# Altium schematic sheet Schematic.SchDoc
size D
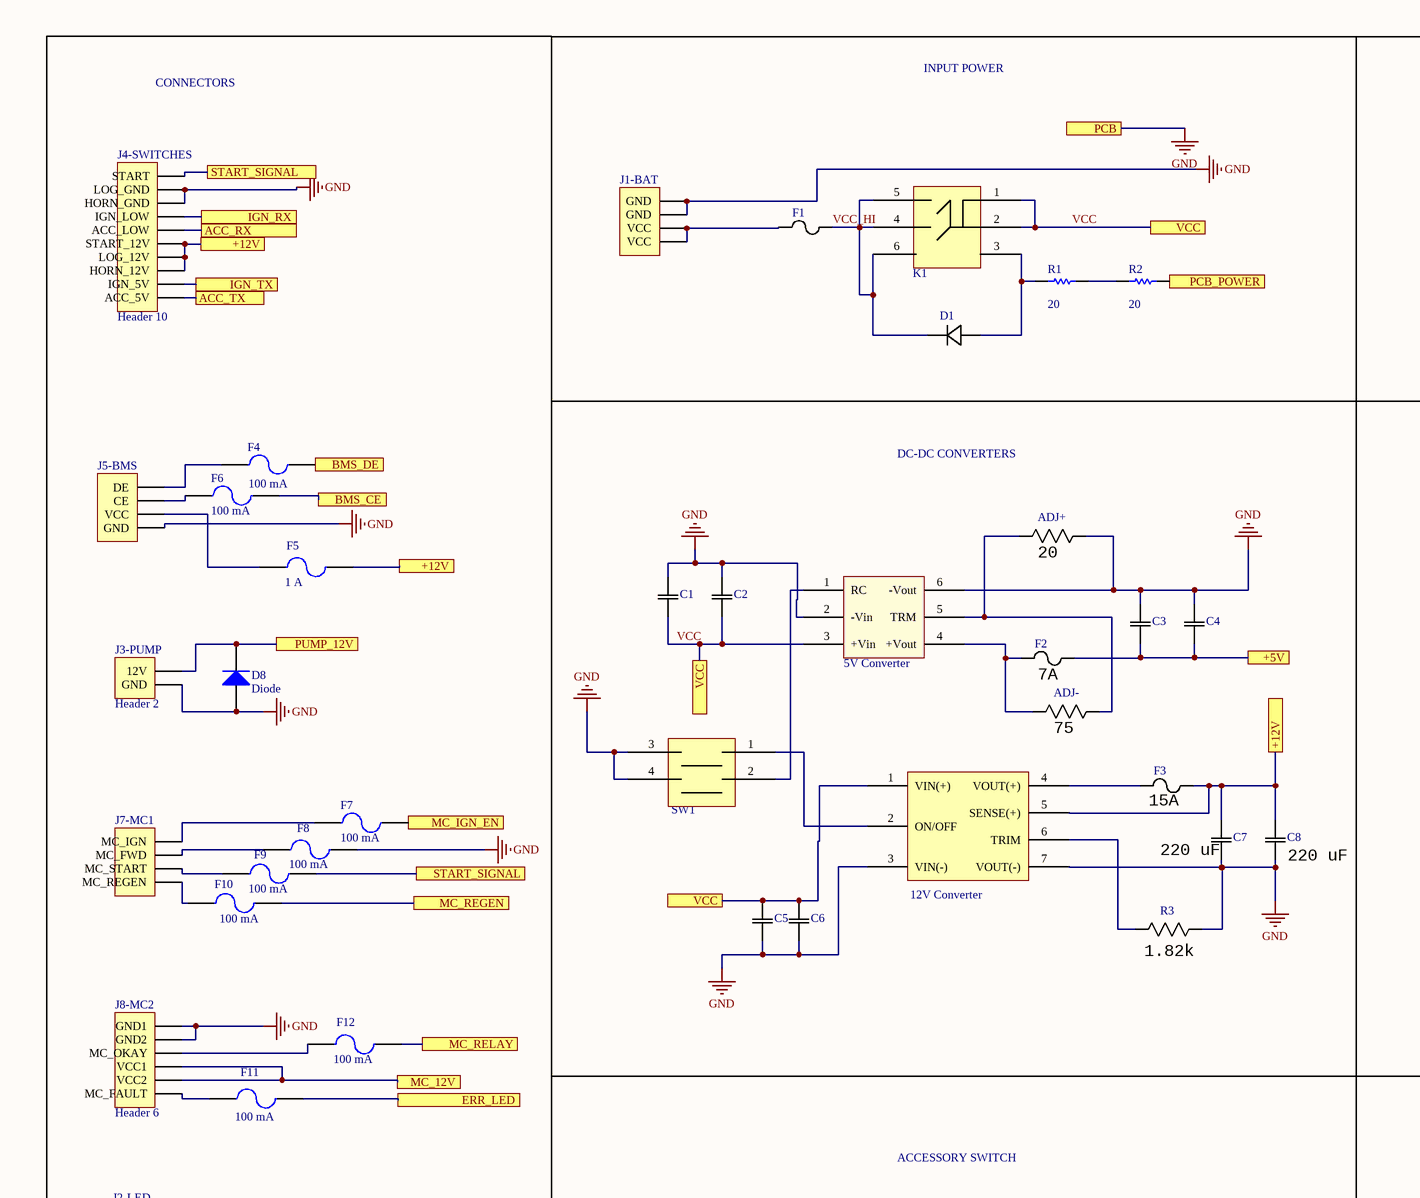
[diagram p0: Schematic.SchDoc, top left]
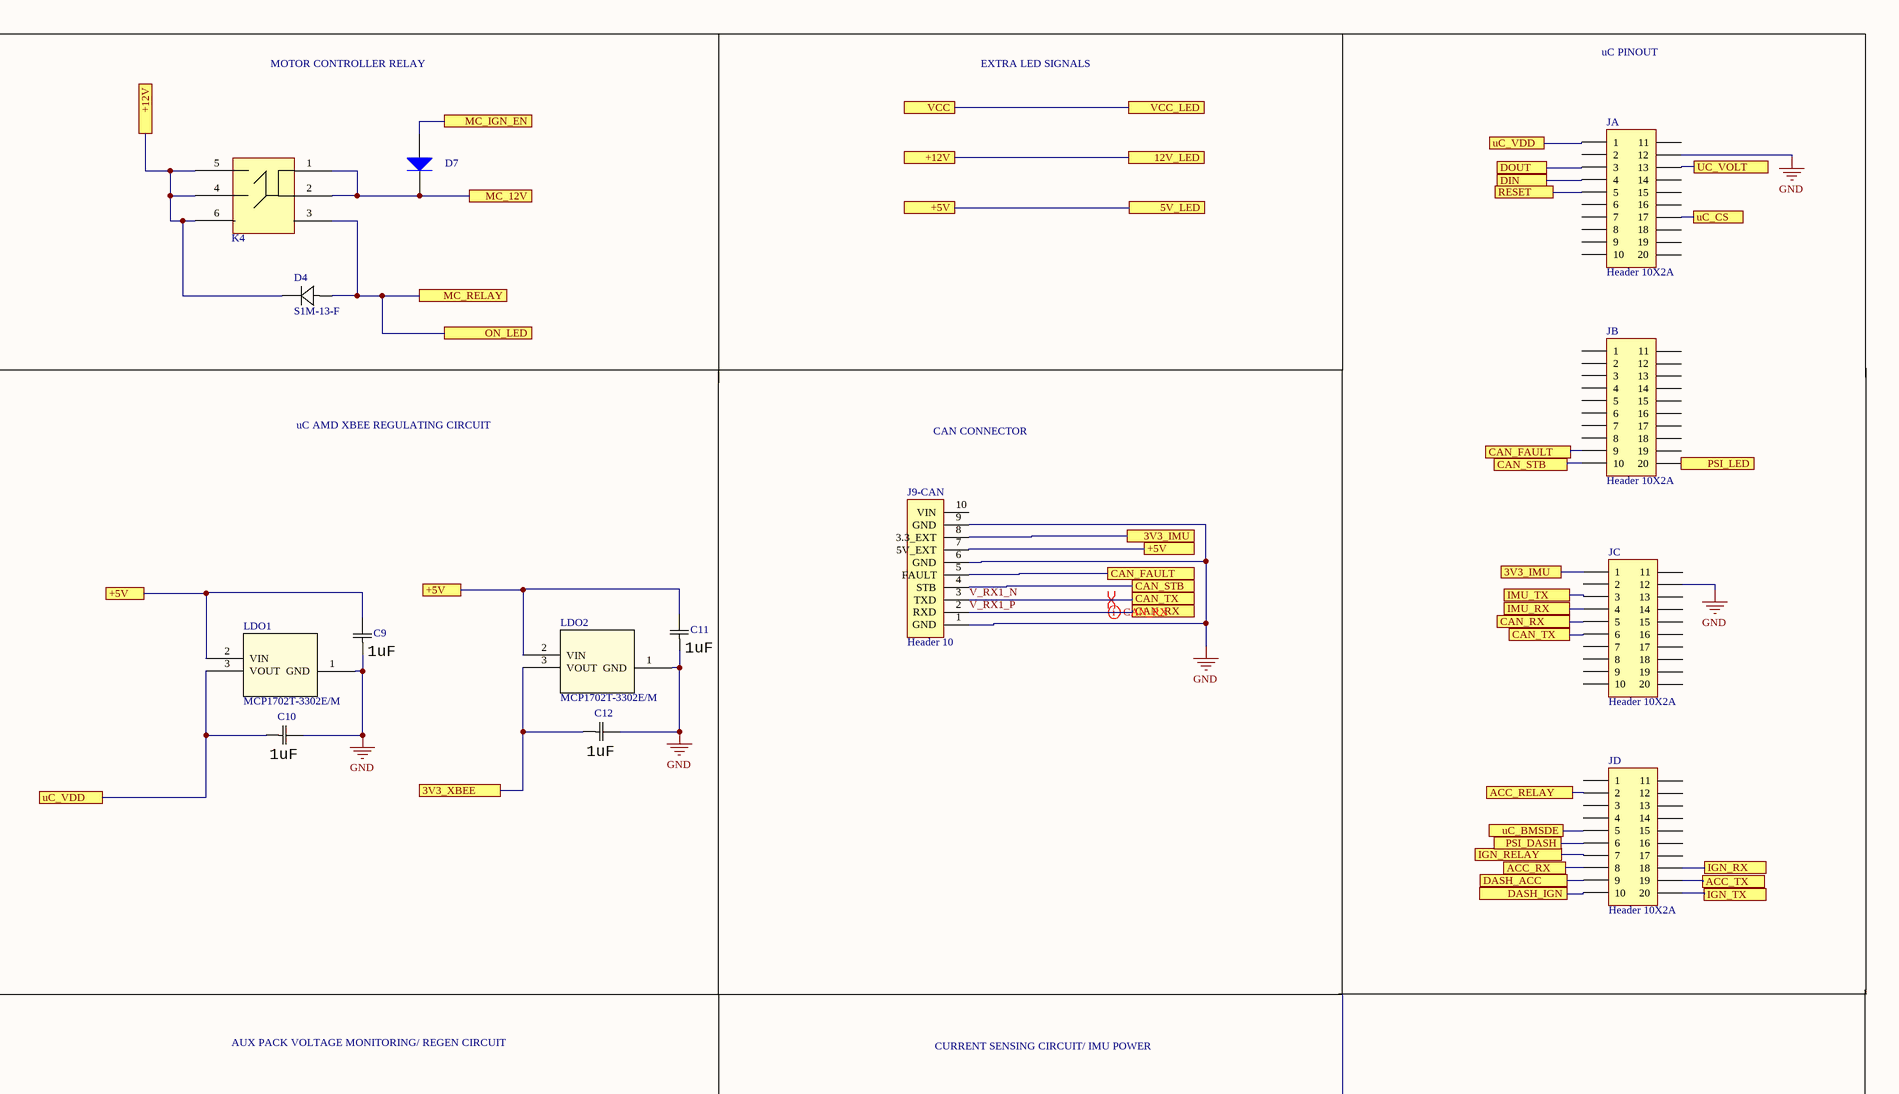
[diagram p1: Schematic.SchDoc, top right]
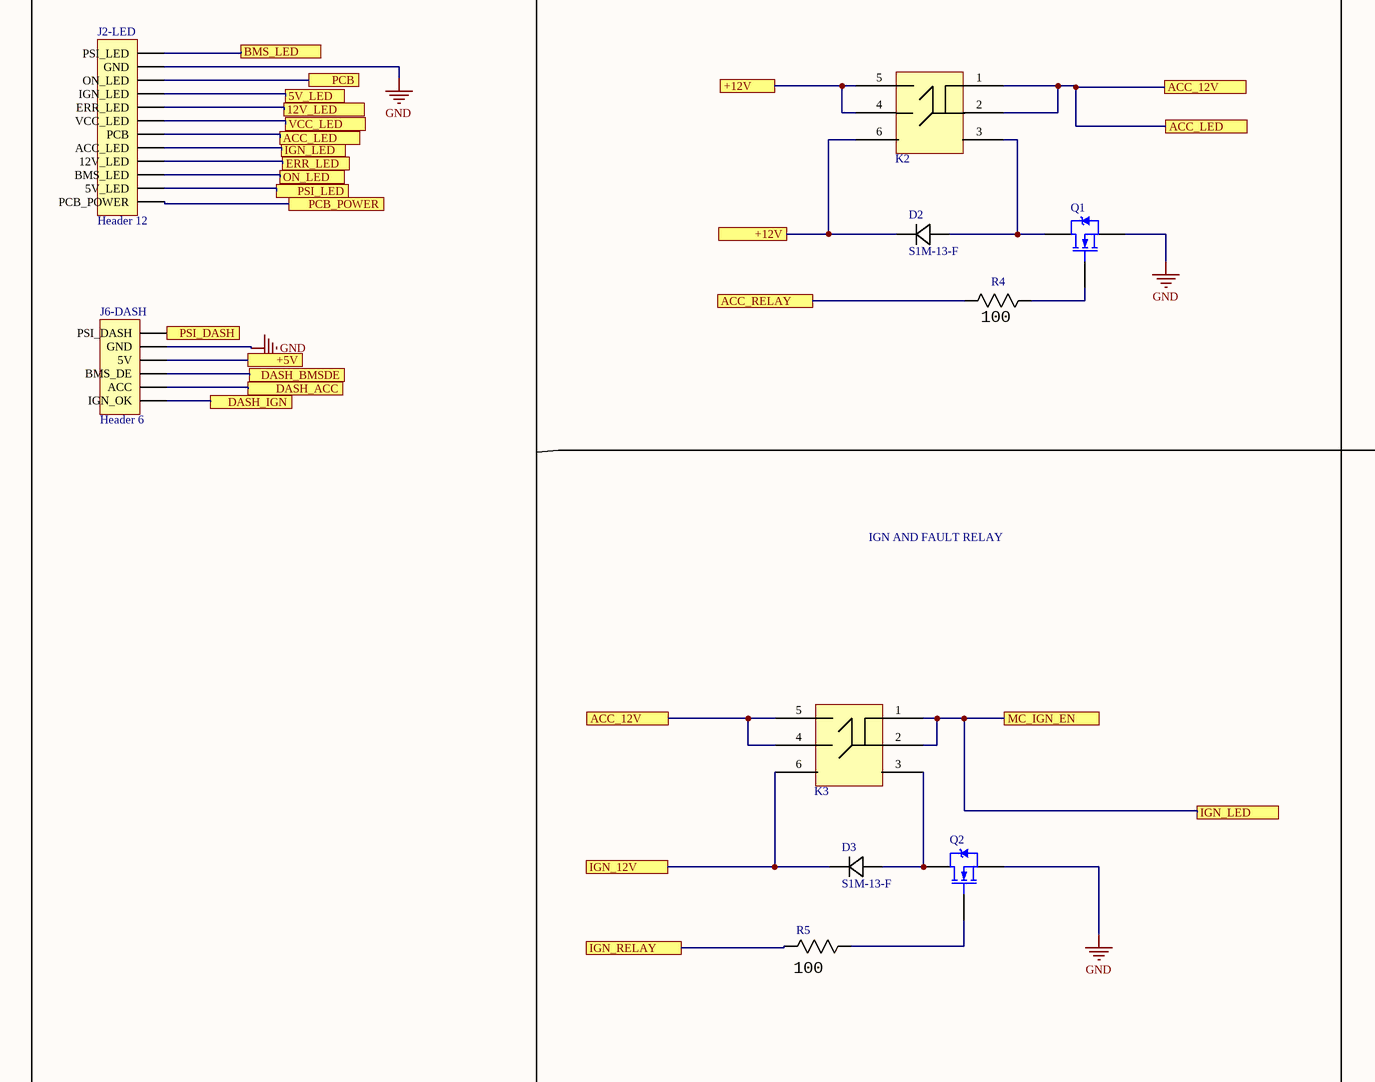
[diagram p2: Schematic.SchDoc, bottom left]
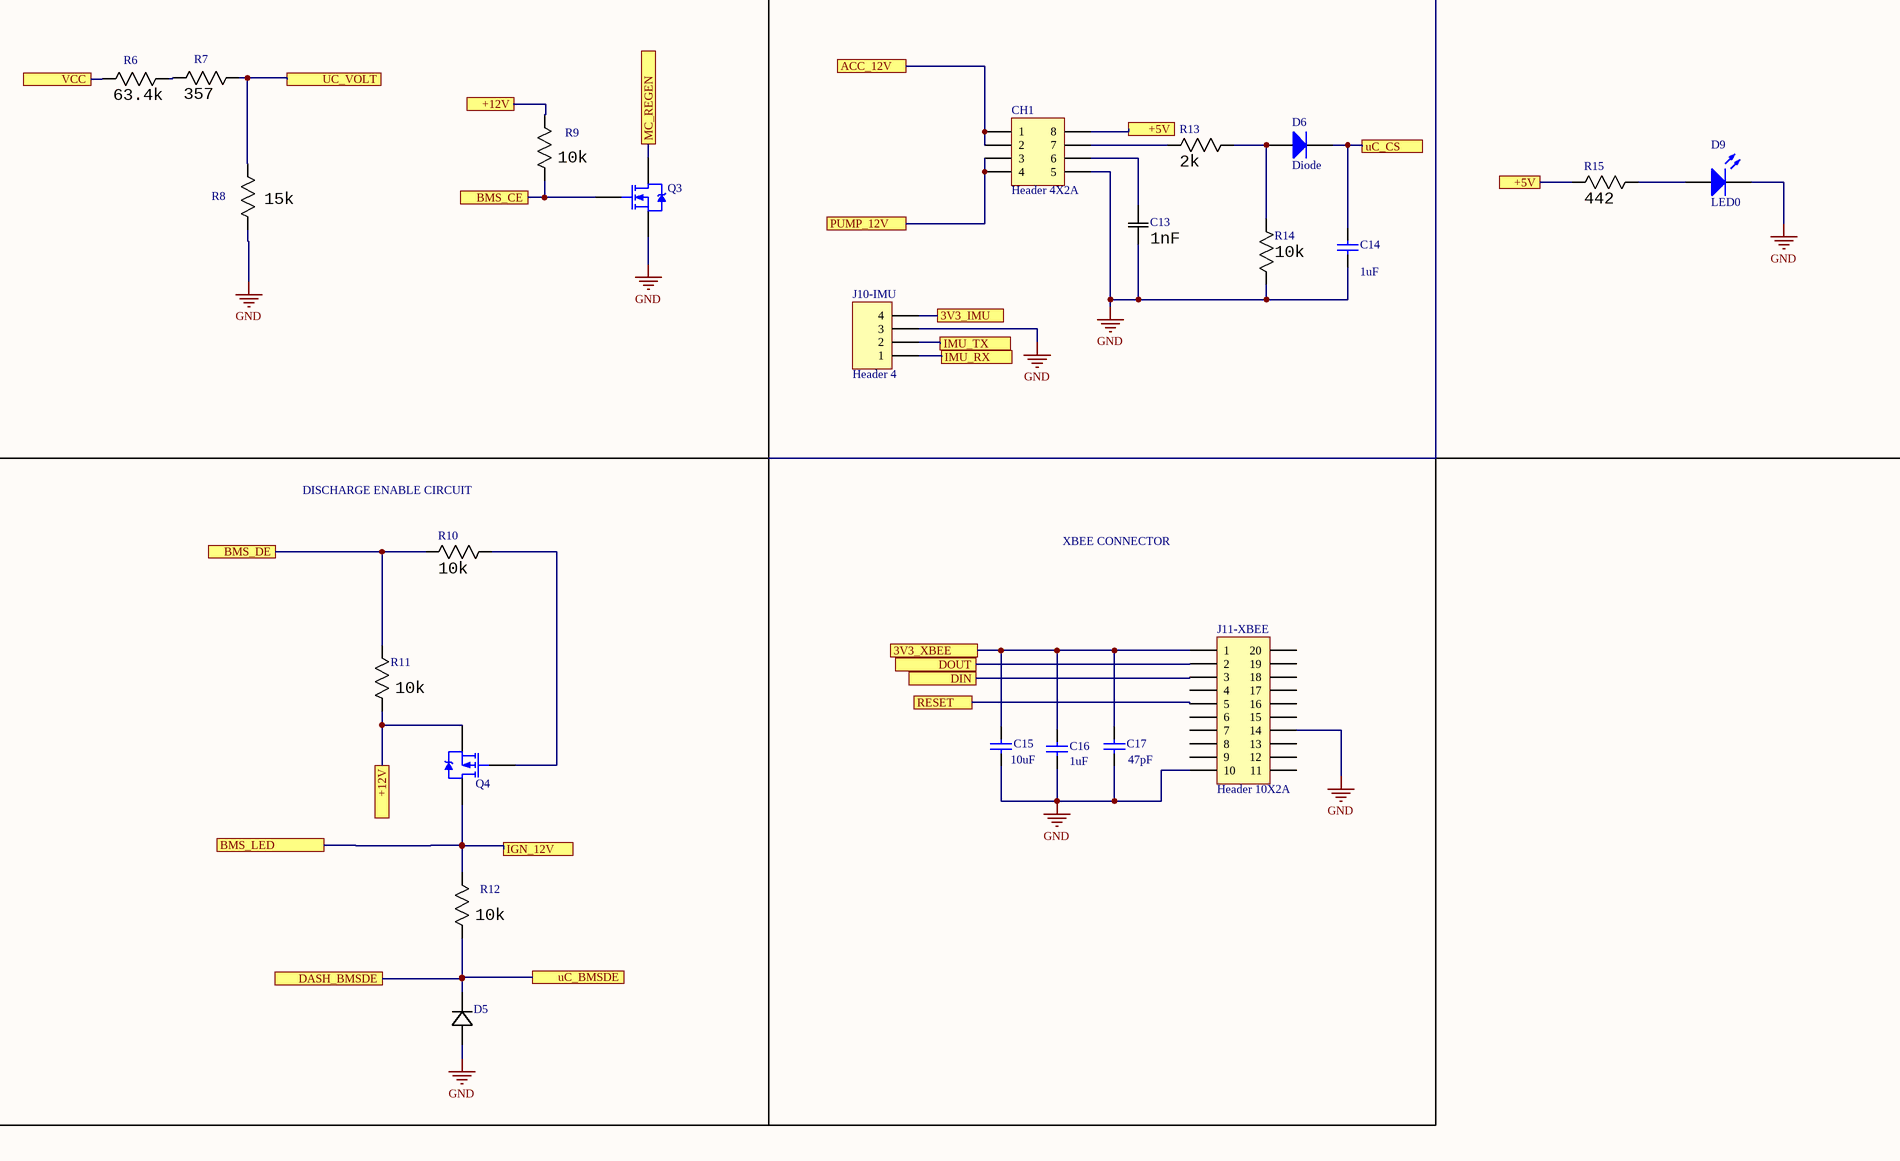
[diagram p3: Schematic.SchDoc, bottom right]

## Parts
5V_Converter  5V CONVERTER  [5V_Converter]  (value not drawn)
12V  Component_3  [12V_Converter]  (value not drawn)
ADJ+  value 20  [RC1206N]  (hidden comment: ERJ-8ENF20R0V)
ADJ-  value 75  [RC1206N]  (hidden comment: ERJ-8ENF20R0V)
C1  TPSE476K035R0200  [CAP_TPS_E]  (value not drawn)
C2  TPSE476K035R0200  [CAP_TPS_E]  (value not drawn)
C3  TPSE476K035R0200  [CAP_TPS_E]  (value not drawn)
C4  TPSE476K035R0200  [CAP_TPS_E]  (value not drawn)
C5  TPSE476K035R0200  [CAP_TPS_E]  (value not drawn)
C6  TPSE476K035R0200  [CAP_TPS_E]  (value not drawn)
C7  value 220 uF  [CAP_TPS_E]  (hidden comment: TPSE476K035R0200)
C8  value 220 uF  [CAP_TPS_E]  (hidden comment: TPSE476K035R0200)
C9  value 1uF  [0603 Cap]  (hidden comment: TPSE476K035R0200)
C10  value 1uF  [0603 Cap]  (hidden comment: TPSE476K035R0200)
C11  value 1uF  [0603 Cap]  (hidden comment: TPSE476K035R0200)
C12  value 1uF  [0603 Cap]  (hidden comment: TPSE476K035R0200)
C13  value 1nF  [0603 Cap]  (hidden comment: TPSE476K035R0200)
C14  value 1uF  [0603 Cap]  (hidden comment: Cap)
C15  value 10uF  [CAP_3216]  (hidden comment: Cap)
C16  value 1uF  [0603 Cap]  (hidden comment: Cap)
C17  value 47pF  [0603 Cap]  (hidden comment: Cap)
CH1  Header 4X2A  [ACS712]
D1  S1M-13-F  [SMA]  (value not drawn)
D2  S1M-13-F  [SMA]
D3  S1M-13-F  [SMA]
D4  S1M-13-F  [SMA]
D5  DZ2J033M0L  [SMini2-F5-B]  (value not drawn)
D6  Diode  [ONSC-SOD-323-2-477-02_G_V]
D7  Diode  [REV_DIODE]  (value not drawn)
D8  Diode  [REV_DIODE]
D9  LED0  [RC1206N]
F1  3413.0330.22  [FUS_SCHURTER_341]  (value not drawn)
F2  value 7A  [FUS_SCHURTER_341]  (hidden comment: 3413.0330.22)
F3  value 15A  [FUS_SCHURTER_341]  (hidden comment: 3413.0330.22)
F4  100 mA  [0603]
F5  1 A  [0466Series]
F6  100 mA  [0603]
F7  100 mA  [0603]
F8  100 mA  [0603]
F9  100 mA  [0603]
F10  100 mA  [0603]
F11  100 mA  [0603]
F12  100 mA  [0603]
J1-BAT  Header 4  [4-pin]  (value not drawn)
J2-LED  Header 12  [12_pinnn]
J3-PUMP  Header 2  [2-pin]
J4-SWITCHES  Header 10  [12-pin]
J5-BMS  Header 4  [4-pin]  (value not drawn)
J6-DASH  Header 6  [6-pin]
J7-MC1  Header 4  [4-pin]  (value not drawn)
J8-MC2  Header 6  [6-pin]
J9-CAN  Header 10  [12-pin]
J10-IMU  Header 4  [4-pin]
J11-XBEE  Header 10X2A  [XBEE]
JA  Header 10X2A  [uC_Pins]
JB  Header 10X2A  [uC_Pins]
JC  Header 10X2A  [uC_Pins]
JD  Header 10X2A  [uC_Pins]
K1  Relays  [Relays]  (value not drawn)
K2  Relays  [Relays]  (value not drawn)
K3  Relays  [Relays]  (value not drawn)
K4  Relays  [Relays]  (value not drawn)
LDO1  MCP1702T-3302E/M  [SOT-89_3MC]
LDO2  MCP1702T-3302E/M  [SOT-89_3MC]
Q1  NMOS-2  [SOT23_M]  (value not drawn)
Q2  NMOS-2  [SOT23_M]  (value not drawn)
Q3  NMOS-2  [DMN13H750S]  (value not drawn)
Q4  PMOS-2  [PCBComponent_1]  (value not drawn)
R1  value 20  [RC1206N]  (hidden comment: Res1)
R2  value 20  [RC1206N]  (hidden comment: Res1)
R3  value 1.82k  [RC1210N]  (hidden comment: ERJ-14NF1821U)
R4  value 100  [RC1206N]  (hidden comment: NTC0805J10K)
R5  value 100  [RC1206N]  (hidden comment: NTC0805J10K)
R6  value 63.4k  [RC1206N]  (hidden comment: ERJ-8ENF20R0V)
R7  value 357  [RC1206N]  (hidden comment: ERJ-8ENF20R0V)
R8  value 15k  [RC1206N]  (hidden comment: ERJ-2BSFR10X)
R9  value 10k  [RC1206N]  (hidden comment: ERJ-8ENF20R0V)
R10  value 10k  [RC1206N]  (hidden comment: ERJ-8ENF20R0V)
R11  value 10k  [RC1206N]  (hidden comment: ERJ-8ENF20R0V)
R12  value 10k  [RC1206N]  (hidden comment: ERJ-8ENF20R0V)
R13  value 2k  [RC1206N]  (hidden comment: ERJ-8ENF20R0V)
R14  value 10k  [RC1206N]  (hidden comment: ERJ-8ENF20R0V)
R15  value 442  [RC1206N]  (hidden comment: ERJ-8ENF20R0V)
S1  Component_2  [SW1]  (value not drawn)

## Ports
3V3_IMU, 3V3_XBEE, 5V_LED, 12V_LED, +5V, +12V, ACC_12V, ACC_LED, ACC_RELAY, ACC_RX, ACC_TX, BMS_CE, BMS_DE, BMS_LED, CAN_FAULT, CAN_RX, CAN_STB, CAN_TX, DASH_ACC, DASH_BMSDE, DASH_IGN, DIN, DOUT, ERR_LED, IGN_12V, IGN_LED, IGN_RELAY, IGN_RX, IGN_TX, IMU_RX, IMU_TX, MC_12V, MC_IGN_EN, MC_REGEN, MC_RELAY, ON_LED, PCB, PCB_POWER, PSI_DASH, PSI_LED, PUMP_12V, RESET, START_SIGNAL, uC_BMSDE, uC_CS, uC_VDD, UC_VOLT, VCC, VCC_LED

## Nets
GND: 5V_Converter.2(-Vin) 5V_Converter.6(-Vout) 12V.3(VIN(-)) 12V.7(VOUT(-)) ADJ+.1 C1.2 C2.2 C3.2 C4.2 C5.1 C6.1 C7.1 C8.1 C9.1 C10.2 C11.1 C12.2 C13.1 C14.1 C15.1 C16.1 C17.1 CH1.5 D5.2 D8.1(A) D9.2(K) F8.2 J1-BAT.1(GND) J1-BAT.2(GND) J2-LED.10(ON_LED) J2-LED.11(GND) J3-PUMP.1(GND) J4-SWITCHES.8(HORN_GND) J4-SWITCHES.9(LOG_GND) J5-BMS.4(GND) J6-DASH.5(GND) J8-MC2.5(GND2) J8-MC2.6(GND1) J9-CAN.1(GND) J9-CAN.6(GND) J9-CAN.9(GND) J10-IMU.3 J11-XBEE.10 J11-XBEE.14 JA.12 JC.12 LDO1.1(GND) LDO2.1(GND) Q1.3(S) Q2.3(S) Q3.3(S) R3.1 R8.2 R14.1 S1.3 S1.4 ; port PCB
3V3_IMU: J9-CAN.8(3.3_EXT) J10-IMU.4 JC.1 ; port 3V3_IMU
3V3_XBEE: C12.1 C15.2 C16.2 C17.2 J11-XBEE.1 LDO2.3(VOUT) ; port 3V3_XBEE
+5V: C3.1 C4.1 C9.2 C11.2 CH1.8 F2.2 J2-LED.9(IGN_LED) J6-DASH.4(5V) J9-CAN.7(5V_EXT) LDO1.2(VIN) LDO2.2(VIN) R15.1 ; port +5V, port 5V_LED
+12V: 12V.5(SENSE(+)) C7.2 C8.2 D2.1 D4.1 F3.2 F5.2 J2-LED.8(ERR_LED) J4-SWITCHES.3(HORN_12V) J4-SWITCHES.4(LOG_12V) J4-SWITCHES.5(START_12V) K2.4 K2.5 K2.6 K4.4 K4.5 K4.6 Q4.3(S) R9.1 R11.2 ; port +12V, port 12V_LED
ACC_12V: CH1.1 CH1.2 J2-LED.6(PCB) K2.1 K2.2 K3.4 K3.5 ; port ACC_12V, port ACC_LED
ACC_RELAY: JD.2 R4.2 ; port ACC_RELAY
ACC_RX: J4-SWITCHES.6(ACC_LOW) JD.8 ; port ACC_RX
ACC_TX: J4-SWITCHES.1(ACC_5V) JD.19 ; port ACC_TX
BMS_CE: F6.2 Q3.1(G) R9.2 ; port BMS_CE
BMS_DE: F4.2 R10.1 R11.1 ; port BMS_DE
BMS_LED: D3.1 J2-LED.12(PSI_LED) K3.6 Q4.2(D) R12.1 ; port IGN_12V, port BMS_LED
CAN_FAULT: J9-CAN.5(FAULT) JB.9 ; port CAN_FAULT
CAN_STB: J9-CAN.4(STB) JB.10 ; port CAN_STB
DASH_ACC: J6-DASH.2(ACC) JD.9 ; port DASH_ACC
DASH_BMSDE: D5.1 J6-DASH.3(BMS_DE) JD.5 R12.2 ; port DASH_BMSDE, port uC_BMSDE
DASH_IGN: J6-DASH.1(IGN_OK) JD.10 ; port DASH_IGN
DIN: J11-XBEE.3 JA.4 ; port DIN
DOUT: J11-XBEE.2 JA.3 ; port DOUT
ERR_LED: F11.2 J2-LED.4(12V_LED) ; port ERR_LED
IGN_LED: D7.1(A) F7.2 J2-LED.5(ACC_LED) K3.1 K3.2 ; port MC_IGN_EN, port IGN_LED
IGN_RELAY: JD.7 R5.2 ; port IGN_RELAY
IGN_RX: J4-SWITCHES.7(IGN_LOW) JD.18 ; port IGN_RX
IGN_TX: J4-SWITCHES.2(IGN_5V) JD.20 ; port IGN_TX
IMU_RX: J10-IMU.1 JC.4 ; port IMU_RX
IMU_TX: J10-IMU.2 JC.3 ; port IMU_TX
MC_12V: D7.2(K) J8-MC2.2(VCC2) J8-MC2.3(VCC1) K4.1 K4.2 ; port MC_12V
MC_REGEN: F10.2 Q3.2(D) ; port MC_REGEN
MC_RELAY: D4.2 F12.2 J2-LED.3(BMS_LED) K4.3 ; port MC_RELAY, port ON_LED
PCB_POWER: J2-LED.1(PCB_POWER) R2.2 ; port PCB_POWER
PSI_DASH: J6-DASH.6(PSI_DASH) JD.6 ; port PSI_DASH
PSI_LED: J2-LED.2(5V_LED) JB.20 ; port PSI_LED
PUMP_12V: CH1.3 CH1.4 D8.2(K) J3-PUMP.2(12V) ; port PUMP_12V
RESET: J11-XBEE.5 JA.5 ; port RESET
START_SIGNAL: F9.2 J4-SWITCHES.10(START) ; port START_SIGNAL
uC_CS: C14.2 D6.2(K) JA.17 ; port uC_CS
uC_VDD: C10.1 JA.1 LDO1.3(VOUT) ; port uC_VDD
UC_VOLT: JA.13 R7.1 R8.1 ; port UC_VOLT
V_RX1_N: J9-CAN.3(TXD) JC.6 ; port CAN_TX
V_RX1_P: J9-CAN.2(RXD) JC.5 ; port CAN_RX
VCC: 5V_Converter.3(+Vin) 12V.1(VIN(+)) C1.1 C2.1 C5.2 C6.2 J2-LED.7(VCC_LED) K1.1 K1.2 R6.2 ; port VCC, port VCC_LED
VCC_HI: D1.1 F1.2 K1.4 K1.5 K1.6
Net5V_Converter_1: 5V_Converter.1(RC) S1.2
Net5V_Converter_4: 5V_Converter.4(+Vout) ADJ-.2 F2.1
Net5V_Converter_5: 5V_Converter.5(TRM) ADJ+.2 ADJ-.1
Net12V_2: 12V.2(ON/OFF) S1.1
Net12V_4: 12V.4(VOUT(+)) F3.1
Net12V_6: 12V.6(TRIM) R3.2
NetC13_2: C13.2 CH1.6
NetCH1_7: CH1.7 R13.1
NetD1_2: D1.2 K1.3 R1.1
NetD2_2: D2.2 K2.3 Q1.2(D)
NetD3_2: D3.2 K3.3 Q2.2(D)
NetD6_1: D6.1(A) R13.2 R14.2
NetD9_1: D9.1(A) R15.2
NetF1_1: F1.1 J1-BAT.3(VCC) J1-BAT.4(VCC)
NetF4_1: F4.1 J5-BMS.1(DE)
NetF5_1: F5.1 J5-BMS.3(VCC)
NetF6_1: F6.1 J5-BMS.2(CE)
NetF7_1: F7.1 J7-MC1.1(MC_IGN)
NetF8_1: F8.1 J7-MC1.2(MC_FWD)
NetF9_1: F9.1 J7-MC1.3(MC_START)
NetF10_1: F10.1 J7-MC1.4(MC_REGEN)
NetF11_1: F11.1 J8-MC2.1(MC_FAULT)
NetF12_1: F12.1 J8-MC2.4(MC_OKAY)
NetQ1_1: Q1.1(G) R4.1
NetQ2_1: Q2.1(G) R5.1
NetQ4_1: Q4.1(G) R10.2
NetR1_2: R1.2 R2.1
NetR6_1: R6.1 R7.2

Not connected (* = marked no-connect by the designer): J9-CAN 10(VIN); J11-XBEE 4 6 7 8 9 11 12 13 15 16 17 18 19 20; JA 2 6 7 8 9 10 11 14 15 16 18 19 20; JB 1 2 3 4 5 6 7 8 11 12 13 14 15 16 17 18 19; JC 2 7 8 9 10 11 13 14 15 16 17 18 19 20; JD 1 3 4 11 12 13 14 15 16 17

## Layout directives
differential pair: V_RX1_N, V_RX1_P

## Notes on the sheet
- CONNECTORS
- INPUT POWER
- MOTOR CONTROLLER RELAY
- EXTRA LED SIGNALS
- uC PINOUT
- DC-DC CONVERTERS
- uC AMD XBEE REGULATING CIRCUIT
- CAN CONNECTOR
- (near S1) SW1
- (near 12V) 12V Converter
- ACCESSORY SWITCH
- AUX PACK VOLTAGE MONITORING/ REGEN CIRCUIT
- CURRENT SENSING CIRCUIT/ IMU POWER
- IGN AND FAULT RELAY
- DISCHARGE ENABLE CIRCUIT
- XBEE CONNECTOR

## Library data of the parts
ADJ+ ADJ- R6-R15 = ERJ-8ENF20R0V: Imported; Vendor: Panasonic; Built_By: EMA_UL_Team; C: Copyright (C) 2015 Accelerated Designs. All rights reserved; Manufacturer_Part_Number: ERJ-8ENF20R0V; RefDes: RefDes; Type: DEV
C1 C2 C5-C13 = TPSE476K035R0200: Imported; Vendor: AVX Corporation; Built_By: EMA_UL_Team; Type: DEV; C: Copyright (C) 2015 Accelerated Designs. All rights reserved; Manufacturer_Part_Number: TPSE476K035R0200; RefDes: RefDes
  C1 C2 C5 C6: Value: Value
C3 C4 = TPSE476K035R0200: Imported; Vendor: AVX Corporation; Built_By: EMA_UL_Team; Type: DEV; Value: 220 uF; C: Copyright (C) 2015 Accelerated Designs. All rights reserved; Manufacturer_Part_Number: TPSE476K035R0200; RefDes: RefDes
C14-C17 = Cap: Capacitor; Published: 8-Jun-2000; LatestRevisionDate: 17-Jul-2002; LatestRevisionNote: Re-released for DXP Platform.; PackageReference: RAD-0.3; Publisher: Altium Limited; PackageDescription: Radial Cap, Thru-Hole; 2 Leads; 0.3 in Pin Spacing
CH1 = Header 4X2A: Header, 4-Pin, Dual row; LatestRevisionDate: 17-Jul-2002; LatestRevisionNote: Re-released for DXP Platform.; Publisher: Altium Limited
D1-D4 = S1M-13-F: Imported; Vendor: Diodes Inc; Built_By: EMA_UL_Team; Type: DEV; C: Copyright (C) 2015 Accelerated Designs. All rights reserved; Manufacturer_Part_Number: S1M-13-F; RefDes: RefDes; Value: Value
D5 = DZ2J033M0L: Imported; Vendor: Panasonic; Type: DEV; C: Copyright (C) 2015 Accelerated Designs. All rights reserved; Manufacturer_Part_Number: DZ2J033M0L; Copyright: Copyright (C) 2015 Accelerated Designs. All rights reserved; RefDes: RefDes; Value: Value
D6-D8 = Diode: Default Diode; Published: 8-Jun-2000; LatestRevisionDate: 17-Jul-2002; LatestRevisionNote: Re-released for DXP Platform.; PackageVersion: Sep-1996; PackageReference: SMC; Publisher: Altium Limited; PackageDescription: DO-214-AB/SMC; 2 C-Bend Leads; Body 7.9 x 5.9 mm, inc. leads (LxW); Code_JEDEC: DO-214-AB
D9 = LED0: Typical INFRARED GaAs LED; Published: 8-Jun-2000; LatestRevisionDate: 08-Jul-2005; LatestRevisionNote: Mech Layer 1 removed.; PackageReference: LED-0; Publisher: Altium Limited; PackageDescription: LED; 2 Leads
F1-F3 = 3413.0330.22: Imported; Vendor: Schurter Inc; Built_By: EMA_UL_Team; Type: DEV; C: Copyright (C) 2015 Accelerated Designs. All rights reserved; Manufacturer_Part_Number: 3413.0330.22; RefDes: RefDes
  F1: Value: Value
F4-F12 = Fuse 2: Fuse; Published: 8-Jun-2000; LatestRevisionDate: 17-Jul-2002; LatestRevisionNote: Re-released for DXP Platform.; PackageReference: PIN-W2/E2.8; Publisher: Altium Limited; PackageDescription: Thru-Hole; 2 Leads
J1-BAT J5-BMS J7-MC1 J10-IMU = Header 4: Header, 4-Pin; LatestRevisionDate: 17-Jul-2002; LatestRevisionNote: Re-released for DXP Platform.; Publisher: Altium Limited
J2-LED = Header 12: Header, 12-Pin; LatestRevisionDate: 17-Jul-2002; LatestRevisionNote: Re-released for DXP Platform.; Publisher: Altium Limited
J3-PUMP = Header 2: Header, 2-Pin; LatestRevisionDate: 17-Jul-2002; LatestRevisionNote: Re-released for DXP Platform.; Publisher: Altium Limited
J4-SWITCHES J9-CAN = Header 10: Header, 10-Pin; LatestRevisionDate: 17-Jul-2002; LatestRevisionNote: Re-released for DXP Platform.; Publisher: Altium Limited
J6-DASH J8-MC2 = Header 6: Header, 6-Pin; LatestRevisionDate: 17-Jul-2002; LatestRevisionNote: Re-released for DXP Platform.; Publisher: Altium Limited
J11-XBEE JA JB JC JD = Header 10X2A: Header, 10-Pin, Dual row; LatestRevisionDate: 17-Jul-2002; LatestRevisionNote: Re-released for DXP Platform.; Publisher: Altium Limited
LDO1 LDO2 = MCP1702T-3302E/M: Imported; Manufacturer_Part_Number: MCP1702T-3302E/MB; Vendor: Microchip; Built_By: EMA_UL_Team; C: Copyright (C) 2015 Accelerated Designs. All rights reserved; RefDes: RefDes; Type: DEV; Value: Value
Q1 Q2 = NMOS-2: N-Channel Power MOSFET; pin to pad: 1>2 2>1; Note: Pin 2 is electrically connected to pin 4.; Published: 8-Jun-2000; LatestRevisionDate: 17-Jul-2002; LatestRevisionNote: Re-released for DXP Platform.; DatasheetVersion: PD-9.814; PackageVersion: Feb-1997; PackageReference: TO-220AB; Publisher: Altium Limited; PackageDescription: TO, Thru-Hole, Vertical, Heatsink Mounted; 3 In-Line Leads; Pitch 2.54 mm; ComponentLink1Description: Manufacturer Link; ComponentLink1URL: http://www.irf.com/
Q3 = NMOS-2: N-Channel Power MOSFET; Note: Pin 2 is electrically connected to pin 4.; Published: 8-Jun-2000; LatestRevisionDate: 17-Jul-2002; LatestRevisionNote: Re-released for DXP Platform.; DatasheetVersion: PD-9.814; PackageVersion: Feb-1997; PackageReference: TO-220AB; Publisher: Altium Limited; PackageDescription: TO, Thru-Hole, Vertical, Heatsink Mounted; 3 In-Line Leads; Pitch 2.54 mm; ComponentLink1Description: Manufacturer Link; ComponentLink1URL: http://www.irf.com/
Q4 = PMOS-2: P-Channel Power MOSFET; Note: Pin 4 not drawn and electrically connected to Pin 2.; Published: 8-Jun-2000; LatestRevisionDate: 17-Jul-2002; LatestRevisionNote: Re-released for DXP Platform.; DatasheetVersion: PD-9.390D; PackageVersion: Feb-1997; PackageReference: TO-220AB; Publisher: Altium Limited; PackageDescription: TO, Thru-Hole, Vertical, Heatsink Mounted; 3 In-Line Leads; Pitch 2.54 mm; ComponentLink1Description: Manufacturer Link; ComponentLink1URL: http://www.irf.com/
R1 R2 = Res1: Resistor; Published: 8-Jun-2000; LatestRevisionDate: 17-Jul-2002; LatestRevisionNote: Re-released for DXP Platform.; PackageReference: AXIAL-0.3; Publisher: Altium Limited; PackageDescription: Axial Device, Thru-Hole; 2 Leads; 0.3 in Pin Spacing
R3 = ERJ-14NF1821U: Imported; Vendor: Panasonic; Built_By: EMA_UL_Team; C: Copyright (C) 2015 Accelerated Designs. All rights reserved; Manufacturer_Part_Number: ERJ-14NF1821U; RefDes: RefDes; Type: DEV
R4 R5 = NTC0805J10K: Imported; Vendor: TE Connectivity; Built_By: EMA_UL_Team; C: Copyright (C) 2015 Accelerated Designs. All rights reserved; Manufacturer_Part_Number: NTC0805J10K; RefDes: RefDes; Type: DEV